# EasyEDA Pro project 主板以及2.4GHz接收器.eprj, board PARTITION1
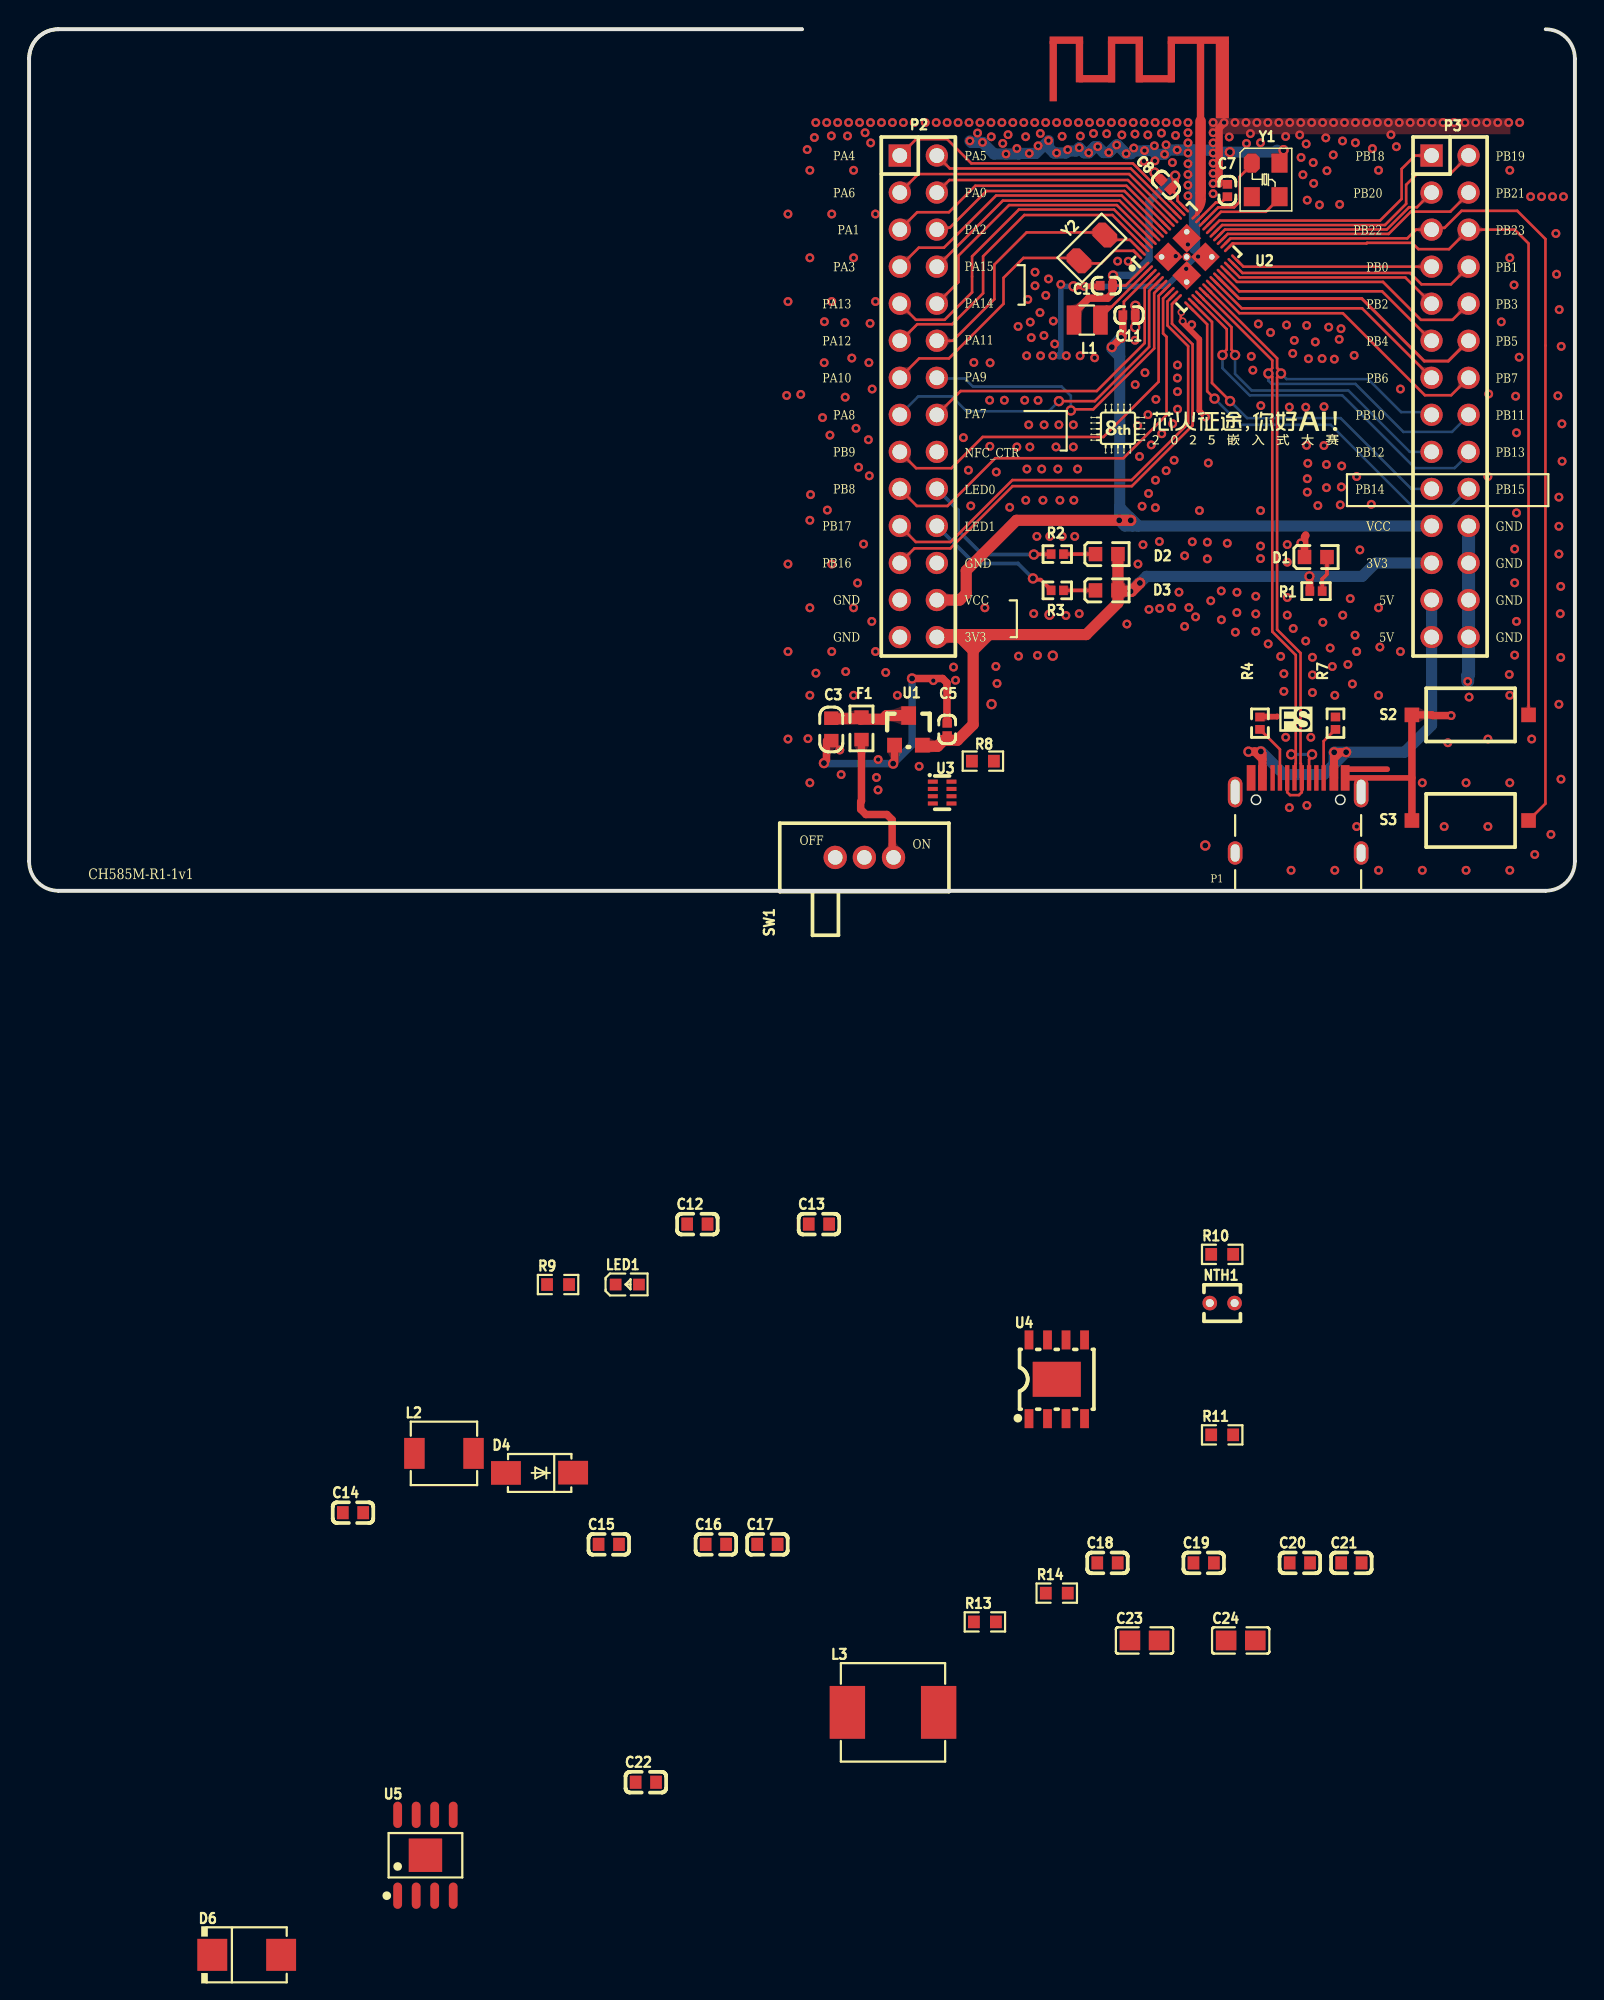
[diagram p10: board, top side]
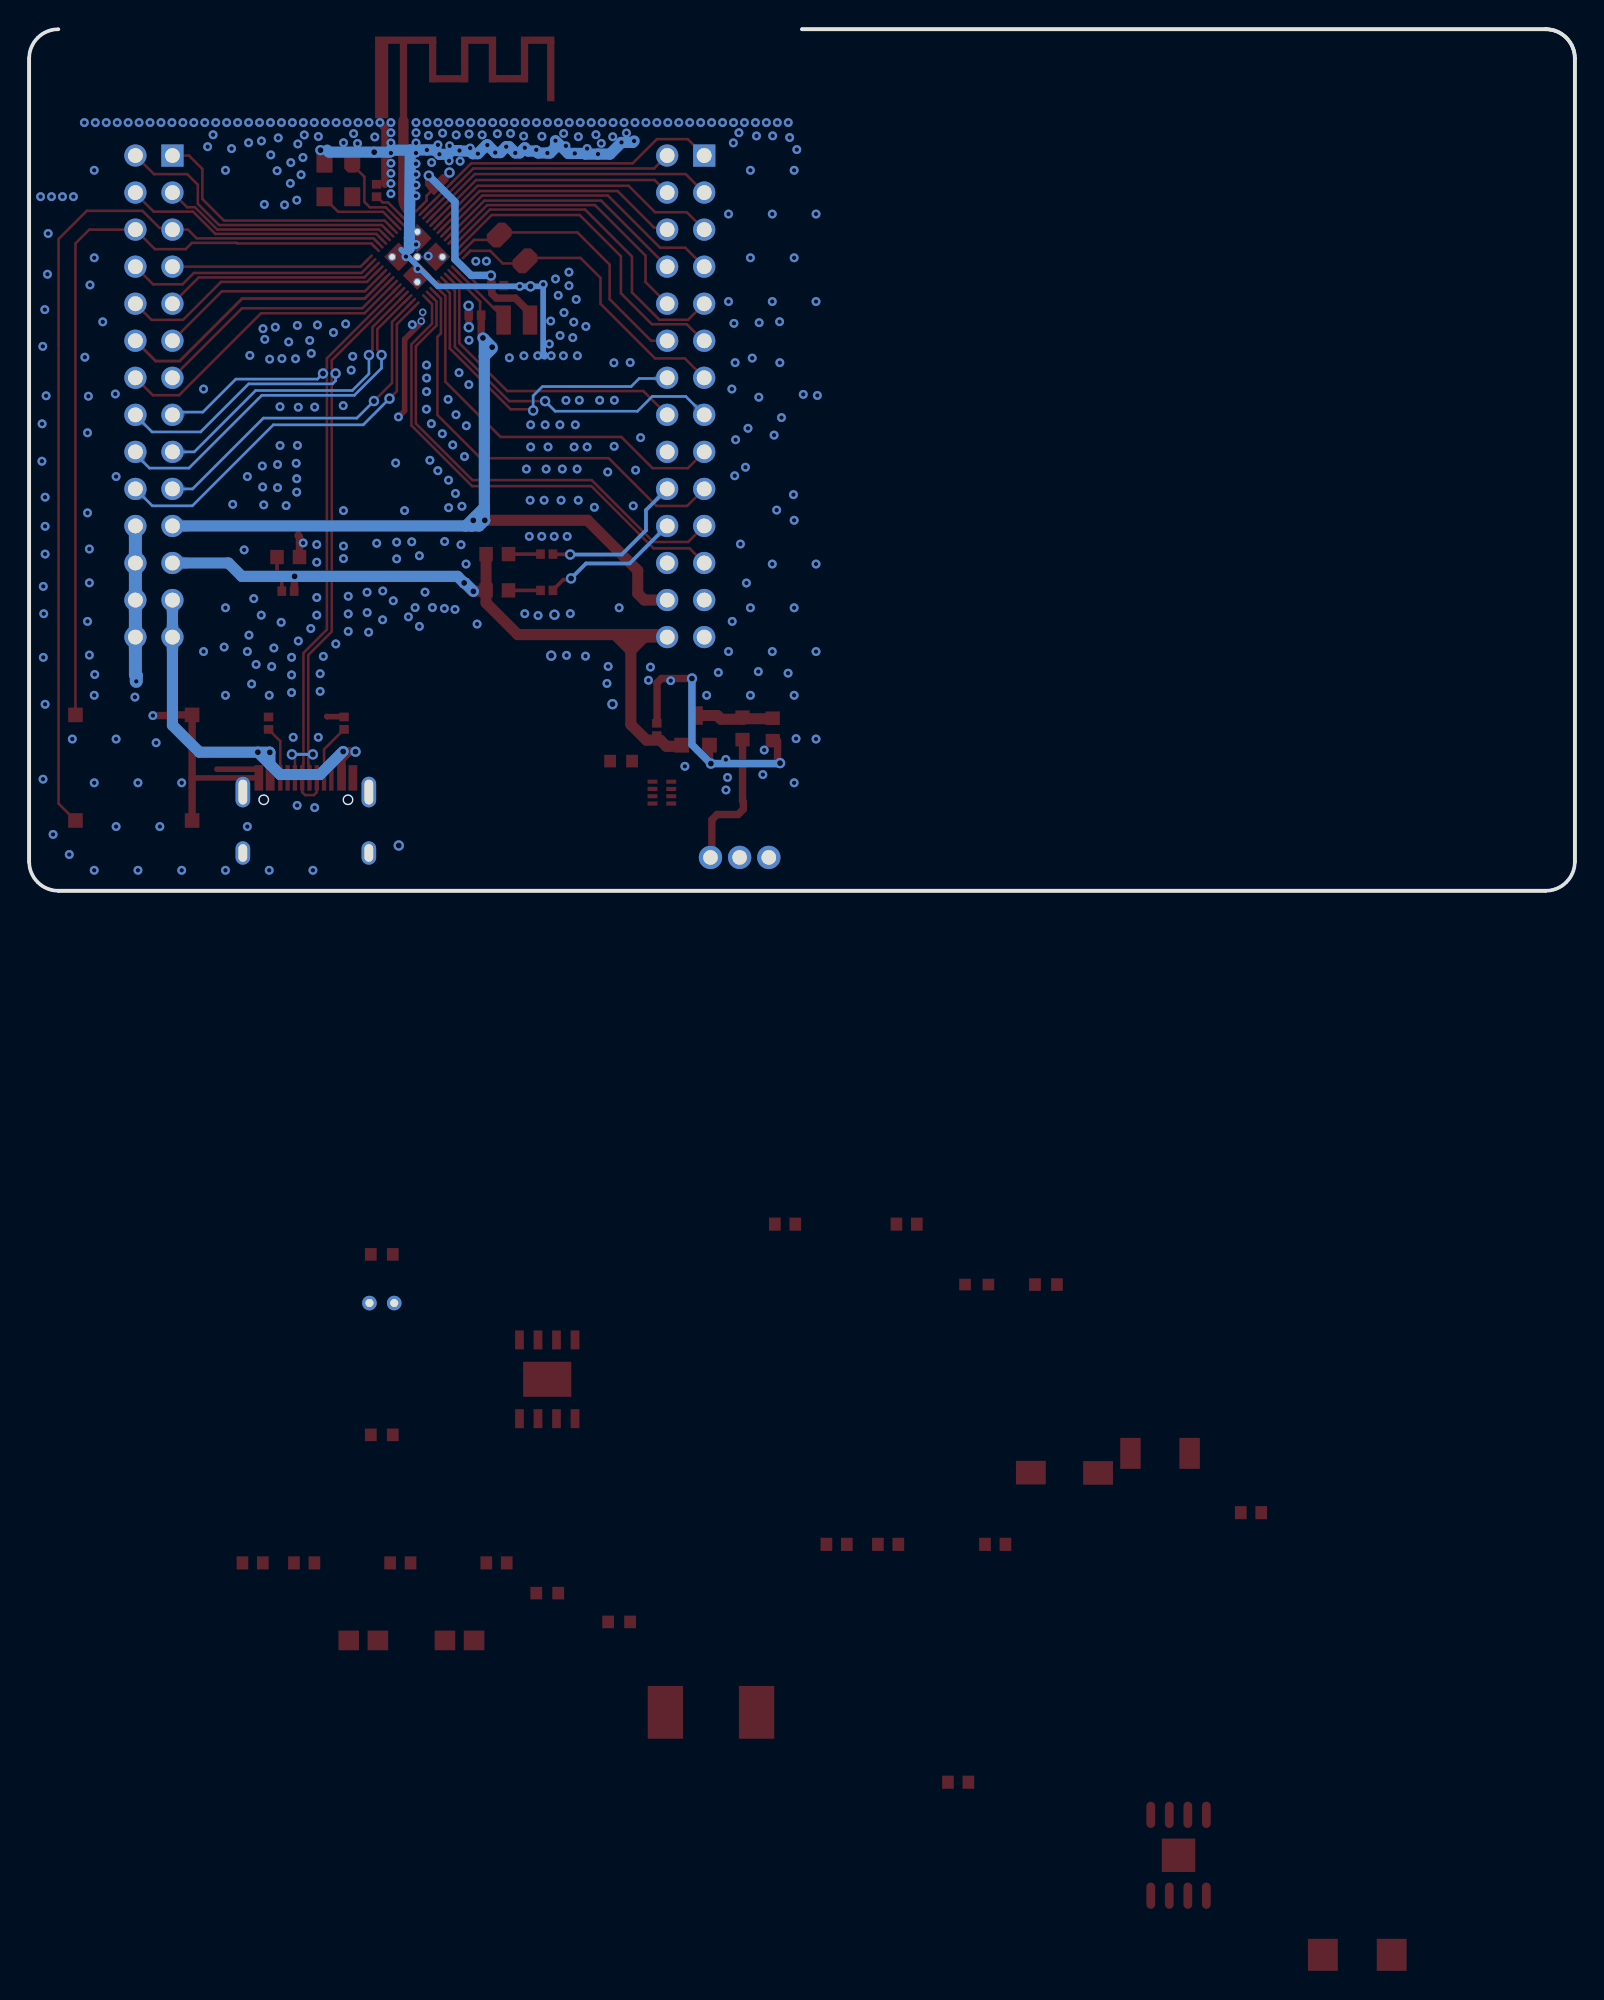
[diagram p11: board, bottom side, seen from below]

Outline 106 x 59.08 mm; copper layers: Top Layer, Bottom Layer. Coordinates in mm from the lower left corner of the outline.
Outline path: 0,57.08 0,2 ; 0,2 0,57.08 ; 0,2 arc(0.59,0.59) 2,0 ; 2,59.08 arc(0.59,58.49) 0,57.08 arc(0.59,58.49) 2,59.08 1.99,59.08 ; 1.99,59.08 53,59.08 1.99,59.08 ; 2,0 104,0 ; 2,0 104,0 ; 104,0 arc(105.41,0.59) 106,2 ; 104,59.08 arc(105.41,58.49) 106,57.08 ; 106,57.08 106,2 ; 106,57.08 106,2
Stack: Top Layer 0.0356mm / Dielectric1 0.32mm FR-4 er 4.8 / Bottom Layer 0.0356mm

## Design rules (mm)
net C3: CH585M-R1-1v1
net C5: CH585M-R1-1v1
net C7: CH585M-R1-1v1
net C8: CH585M-R1-1v1
net C11: CH585M-R1-1v1
net F1: CH585M-R1-1v1
net L1: CH585M-R1-1v1
net P2: CH585M-R1-1v1
net P3: CH585M-R1-1v1
net R1: CH585M-R1-1v1
net R2: CH585M-R1-1v1
net R3: CH585M-R1-1v1
net U1: CH585M-R1-1v1
net Y1: CH585M-R1-1v1
net Y2: CH585M-R1-1v1
net E1: CH585M-R1-1v1
net R4: CH585M-R1-1v1
net R7: CH585M-R1-1v1
net S1: CH585M-R1-1v1
net S2: CH585M-R1-1v1
net S3: CH585M-R1-1v1
net C1: CH585M-R1-1v1
net D1: CH585M-R1-1v1
net D2: CH585M-R1-1v1
net D3: CH585M-R1-1v1
net P4: CH585M-R1-1v1
net R8: CH585M-R1-1v1
net R11: CH585M-R1-1v1
net P1: CH585M-R1-1v1
net U2: CH585M-R1-1v1
net C4: CH585M-R1-1v1
net C6: CH585M-R1-1v1
net C9: CH585M-R1-1v1
net C10: CH585M-R1-1v1
net C12: CH585M-R1-1v1
net C13: CH585M-R1-1v1
net C14: CH585M-R1-1v1
net C15: CH585M-R1-1v1
net C16: CH585M-R1-1v1
net C17: CH585M-R1-1v1
net L2: CH585M-R1-1v1
net L3: CH585M-R1-1v1
net R12: CH585M-R1-1v1
net R13: CH585M-R1-1v1
net R14: CH585M-R1-1v1
net R15: CH585M-R1-1v1
net R16: CH585M-R1-1v1
net C2: CH585M-R1-1v1
net R17: CH585M-R1-1v1
net PB12: NewDifferentialPair2
net PB13: NewDifferentialPair2
net PB11: NewDifferentialPair1
net PB10: NewDifferentialPair1
spacing Clearance_1: track to track 0.152, other pairs 0.152 to 0.152
spacing Clearance (default): track to track 0.127, other pairs 0 to 0.152
spacing Clearance_3: track to track 0.254, other pairs 0 to 0.254
track width Width (default): min 0.127, default 0.178, max 1.27
differential pair DiffPairsRouting (default): width min 0.178, default 0.381, max 0.381; gap min 0.152, default 0.254
via RoutingVias (default): diameter min 0.508, default 0.61, max 1.27; hole min 0.305, default 0.305, max 0.711
net ANT uses Clearance_1

## Placement (name value [footprint] x y rotation side)
C1  4.7uF  [0402_C]  73.45 41.49 90 top
C3  10uF  [0603_C]  55.01 11.83 270 top
C5  2.2uF  [0402_C]  62.96 10.64 180 top
C7  0.47uF  [0402_C]  82.17 47.59 180 top
C8  0.1uF  [0402_C]  78.25 48.12 225 top
C11  2.2uF  [0402_C]  75.85 39.47 270 top
C12  22uF  [C0603]  45.82 -22.86 0 top
C13  22uF  [C0603]  54.16 -22.86 0 top
C14  100nF  [C0603]  22.21 -42.64 0 top
C15  10uF  [C0603]  39.75 -44.82 0 top
C16  10uF  [C0603]  47.09 -44.82 0 top
C17  10uF  [C0603]  50.63 -44.82 0 top
C18  10uF  [C0603]  73.95 -46.09 0 top
C19  10uF  [C0603]  80.55 -46.09 0 top
C20  10uF  [C0603]  87.14 -46.09 0 top
C21  10uF  [C0603]  90.68 -46.09 0 top
C22  100nF  [C0603]  42.29 -61.13 0 top
C23  22uF  [C0805]  76.49 -51.41 0 top
C24  22uF  [C0805]  83.09 -51.41 0 top
D1  POWER  [0603+]  89 22.88 180 top
D2  LED0  [0603+]  74.67 23.09 180 top
D3  LED1  [0603+]  74.67 20.6 180 top
D4  SS54  [SMA_L4.3-W2.6-LS5.0-FD]  35 -39.91 0 top
D6  SS54SMB  [SMB_L4.6-W3.6-LS5.3-RD]  14.92 -72.97 0 top
E1  ANTENNA  [ANT-F-1-2.4G-1.6mmFR4]  80.34 53.28 0 top
F1  500mA  [0603]  57.08 10.36 90 top
L1  10uH  [SMD_2x2mm]  72.56 39.13 180 top
L2  2.2uH  [IND-SMD_L4.4-W4.2]  28.45 -38.58 0 top
L3  15uH  [IND-SMD_L7.0-W6.6_FXL0630]  59.24 -56.34 0 top
LED1  LTST-C190KSKT  [LED0603-RD]  41.02 -27 0 top
NTH1  100K  [RES-TH_L2.5-W2.5-P1.70-D0.3]  81.82 -28.27 0 top
P1  TYPE-C FS-USB  [TYPE-C-Receptacle-2.0]  87.03 7.74 0 top
P2  HEADER 14x2  [IDC28-2.54MM]  59.71 50.42 0 top
P3  HEADER 14x2  [IDC28-2.54MM]  96.17 50.42 0 top
R1  1K  [0402]  88.68 20.55 180 top
R2  1K  [0402]  70.08 23.09 0 top
R3  1K  [0402]  70.08 20.6 0 top
R4  5.1K  [0402]  84.41 11.92 270 top
R7  5.1K  [0402]  89.58 11.07 90 top
R8  10kΩ  [R0603]  65.41 8.89 0 top
R9  1kΩ  [R0603]  36.27 -27 0 top
R10  82kΩ  [R0603]  81.82 -24.93 0 top
R11  1kΩ  [R0603]  81.82 -37.31 0 top
R13  10kΩ  [R0603]  65.54 -50.14 0 top
R14  3.16kΩ  [R0603]  70.47 -48.16 0 top
S2  RST#  [SMD_6.1x3.65x2.5mm-KEY]  94.83 12.06 0 top
S3  Download  [SMD_6.1x3.65x2.5mm-KEY]  94.83 4.82 0 top
SW1  SSSS916900  [SW-TH_SSSS916900]  57.28 2.29 90 top
U1  6219P33M  [SOT-23]  59.35 9.98 0 top
U2  CH585M  [QFN48_5X5]  79.38 43.46 315 top
U3  LM66200DRLR  [SOT-583-8_L2.1-W1.2-P0.50-LS1.6-BL]  62.61 6.73 270 top
U4  SCS5090EA  [ESOP-8_L4.9-W3.9-P1.27-LS6.0-BL-EP3.3]  70.47 -33.5 0 top
U5  TPS5450DDAR  [SOP-8_L4.9-W3.9-P1.27-LS6.0-BL-EP]  27.18 -66.14 0 top
Y1  32MHz  [XT3225]  83.85 49.89 270 top
Y2  32.768K  [fc-135]  72 43.2 45 top

## Footprints (pads in the part's own frame, mm; a bottom-side part is the same pattern mirrored in y, then rotated)
0402
  rect 0.6x0.65 smd: 1(0,0) 2(0.85,0)
0402_C
  rect 0.65x0.6 smd: 1(0,0) 2(0,-0.85)
0603
  rect 0.93x0.98 smd: 1(0,0) 2(1.54,0)
0603+
  rect 0.93x0.98 smd: 1(0,0) 2(1.54,0)
0603_C
  rect 0.93x0.98 smd: 1(0,0) 2(1.54,0)
ANT-F-1-2.4G-1.6mmFR4
  rect 0.8x0.6 smd: 0(1.483,0)
  rect 0.4x0.6 smd: 1(0,0)
C0603
  rect 0.8x0.9 smd: 1(-0.7,0) 2(0.7,0)
C0805
  rect 1.41x1.35 smd: 1(-1,0) 2(1,0)
ESOP-8_L4.9-W3.9-P1.27-LS6.0-BL-EP3.3
  rect 0.6x1.3 smd: 1(-1.905,-2.7) 2(-0.635,-2.7) 3(0.635,-2.7) 4(1.905,-2.7) 5(1.905,2.7) 6(0.635,2.7) 7(-0.635,2.7) 8(-1.905,2.7)
  rect 3.3x2.4 smd: 9(0,0)
fc-135
  custom 1.27x1.778 smd: 1(0,0) 2(2.5,0)
IDC28-2.54MM
  rect 1.524x1.524 hole 1.016: 1(0,0)
  round 1.524 hole 1.016: 2(2.54,0) 3(0,-2.54) 4(2.54,-2.54) 5(0,-5.08) 6(2.54,-5.08) 7(0,-7.62) 8(2.54,-7.62) 9(0,-10.16) 10(2.54,-10.16) 11(0,-12.7) 12(2.54,-12.7) 13(0,-15.24) 14(2.54,-15.24) 15(0,-17.78) 16(2.54,-17.78) 17(0,-20.32) 18(2.54,-20.32) 19(0,-22.86) 20(2.54,-22.86) 21(0,-25.4) 22(2.54,-25.4) 23(0,-27.94) 24(2.54,-27.94) 25(0,-30.48) 26(2.54,-30.48) 27(0,-33.02) 28(2.54,-33.02)
IND-SMD_L4.4-W4.2
  rect 1.4x2.12 smd: 1(2.028,0) 2(-2.028,0)
IND-SMD_L7.0-W6.6_FXL0630
  rect 2.424x3.62 smd: 1(3.128,0) 2(-3.128,0)
LED0603-RD
  rect 0.8x0.8 smd: 1(-0.799,0) 2(0.799,0)
QFN48_5X5
  round 0.559 hole 0.381: 0(-1.219,1.219) 0(-1.219,-1.219) 0(0,0) 0(1.219,1.219) 0(1.219,-1.219)
  rect 1.397x1.397 smd: 0(-0.901,0.908) 0(-0.901,-0.895) 0(0.902,0.908) 0(0.902,-0.895)
  oval 0.18x0.9 smd: 1(-1.575,-2.518) 2(-1.225,-2.518) 3(-0.875,-2.518) 4(-0.525,-2.518) 5(-0.175,-2.518) 6(0.175,-2.518) 7(0.525,-2.518) 8(0.875,-2.518) 9(1.225,-2.518) 10(1.575,-2.518) 25(1.575,2.518) 26(1.225,2.518) 27(0.875,2.518) 28(0.525,2.518) 29(0.175,2.518) 30(-0.175,2.518) 31(-0.525,2.518) 32(-0.875,2.518) 33(-1.225,2.518) 34(-1.575,2.518)
  oval 0.9x0.18 smd: 11(2.514,-2.275) 12(2.514,-1.925) 13(2.514,-1.575) 14(2.514,-1.225) 15(2.514,-0.875) 16(2.514,-0.525) 17(2.514,-0.175) 18(2.514,0.175) 19(2.514,0.525) 20(2.514,0.875) 21(2.514,1.225) 22(2.514,1.575) 23(2.514,1.925) 24(2.514,2.275) 35(-2.514,2.275) 36(-2.514,1.925) 37(-2.514,1.575) 38(-2.514,1.225) 39(-2.514,0.875) 40(-2.514,0.525) 41(-2.514,0.175) 42(-2.514,-0.175) 43(-2.514,-0.525) 44(-2.514,-0.875) 45(-2.514,-1.225) 46(-2.514,-1.575) 47(-2.514,-1.925) 48(-2.514,-2.275)
R0603
  rect 0.806x0.864 smd: 1(-0.753,0) 2(0.753,0)
RES-TH_L2.5-W2.5-P1.70-D0.3
  round 1 hole 0.55: 1(-0.85,0) 2(0.85,0)
SMA_L4.3-W2.6-LS5.0-FD
  rect 2.046x1.62 smd: 1(-2.304,-0.009) 2(2.304,0.009)
SMB_L4.6-W3.6-LS5.3-RD
  rect 2.047x2.192 smd: 1(-2.361,0) 2(2.361,0)
SMD_2x2mm
  rect 1x2 smd: 1(-0.905,0) 2(0.905,0)
SMD_6.1x3.65x2.5mm-KEY
  rect 1x1 smd: 1(0,0) 2(8,0)
SOP-8_L4.9-W3.9-P1.27-LS6.0-BL-EP
  oval 0.6x1.8 smd: 1(-1.905,-2.772) 2(-0.635,-2.772) 3(0.635,-2.772) 4(1.905,-2.772) 5(1.905,2.772) 6(0.635,2.772) 7(-0.635,2.772) 8(-1.905,2.772)
  rect 2.29x2.29 smd: 9(0,0)
SOT-23
  rect 1.016x1.016 smd: 1(0,0) 2(1.905,0)
  rect 1.016x1.27 smd: 3(0.965,2.032)
SOT-583-8_L2.1-W1.2-P0.50-LS1.6-BL
  rect 0.28x0.68 smd: 1(-0.75,-0.64) 2(-0.25,-0.64) 3(0.25,-0.64) 4(0.75,-0.64) 5(0.75,0.64) 6(0.25,0.64) 7(-0.25,0.64) 8(-0.75,0.64)
SW-TH_SSSS916900
  round 1.6 hole 1: 1(0,2) 2(0,0) 3(0,-2)
TYPE-C-Receptacle-2.0
  oval 1x2.1 hole 0.6x1.7: 0(-4.32,-0.97) 0(4.32,-0.97)
  oval 1x1.6 hole 0.6x1.2: 0(-4.32,-5.15) 0(4.32,-5.15)
  rect 0.6x1.75 smd: A1(-3.225,0) A4(-2.45,0) B1(3.225,0) B4(2.45,0)
  rect 0.3x1.75 smd: A5(-1.25,0) A6(-0.25,0) A7(0.25,0) A8(1.25,0) B5(1.75,0) B6(0.75,0) B7(-0.75,0) B8(-1.75,0)
XT3225
  custom 1.3x1.1 smd: 1(0,0)
  rect 1.3x1.1 smd: 2(2.3,0) 3(2.3,1.9) 4(0,1.9)

## Nets
+3V3: C5.1 D2.1 D3.1 P2.28 P3.23 R1.2 U1.2
+5V: C12.2 C13.2 C14.2 L2.1 P1.A4 P1.B4 P1.B5 P3.25 P3.27 R7.1 R8.2 R9.1 U3.3 U4.1
GND: C1.1 C3.2 C5.2 C7.2 C8.2 C11.1 C12.1 C13.1 C14.1 C15.1 C16.1 C17.1 C18.1 C19.1 C20.1 C21.1 C23.2 C24.2 D1.2 NTH1.2 P1.A1 P1.B1 P2.24 P2.25 P2.27 P3.22 P3.24 P3.26 P3.28 R4.1 R7.2 R10.2 R11.2 R14.2 S2.1 S3.1 U1.1 U2.0 U3.1 U3.4 U3.5 U4.2 U4.9 U5.6 Y1.2 Y1.4
V5V: C3.1 F1.2 U1.3
VCC: C11.2 P2.26 P3.21 U2.3
VINTA: C7.1 U2.33
ANT: E1.1 U2.34
BAT+: C18.2 C19.2 C20.2 C21.2 U4.5 U5.7
BATO: C23.1 C24.1 L3.2 R13.1 U3.6
BOOT: P3.5 S3.2 U2.26
EP: C22.2 D6.1 L3.1 U5.8
FB: R13.2 R14.1 U5.4
LED0: P2.20 R2.1
LED1: P2.22 R3.1
LX: D4.1 L2.2 U4.3
PA0: P2.4 U2.39
PA1: P2.5 U2.40
PA2: P2.6 U2.41
PA3: P2.7 U2.42
PA4: P2.1 U2.36
PA5: P2.2 U2.37
PA6: P2.3 U2.38
PA7: P2.16 U2.4
PA8: P2.15 U2.5
PA9: P2.14 U2.6
PA10: P2.13 U2.48 Y2.1
PA11: P2.12 U2.47 Y2.2
PA12: P2.11 U2.46
PA13: P2.9 U2.45
PA14: P2.10 U2.44
PA15: P2.8 U2.43
PB0: P3.7 U2.24
PB1: P3.8 U2.23
PB2: P3.9 U2.22
PB3: P3.10 U2.21
PB4: P3.11 U2.20
PB5: P3.12 U2.19
PB6: P3.13 U2.18
PB7: P3.14 U2.17
PB10: P1.A7 P1.B7 P3.15 U2.16
PB11: P1.A6 P1.B6 P3.16 U2.15
PB12: P3.17 U2.14
PB13: P3.18 U2.13
PB14: P3.19 U2.12
PB15: P3.20 U2.11
PB18: P3.1 U2.30
PB19: P3.2 U2.29
PB20: P3.3 U2.28
PB21: P3.4 U2.27
PB23: P3.6 S2.2 U2.25
STAT: LED1.1 U4.8
V_SYS: SW1.2 U3.2 U3.7
VBS: C15.2 C16.2 C17.2 D4.2 U4.4
VDCID: C1.2 C8.1 L1.2 U2.1 U2.35
VSW: L1.1 U2.2
X32MI: U2.32 Y1.1
X32MO: U2.31 Y1.3
$1N3: F1.1 SW1.3
$1N110: P1.A5 R4.2
$1N164: D1.1 R1.1
$1N985: D2.2 R2.2
$1N986: D3.2 R3.2
$1N5275: R8.1 U3.8
$1N7704: LED1.2 R9.2
$1N7911: NTH1.1 R10.1 U4.7
$1N8019: R11.1 U4.6
$1N8947: C22.1 U5.1
$1N8982: D6.2 U5.9

Pads without a net: E1 0; P1 0 A8 B8; P2 17 18 19 21 23; SW1 1; U2 7 8 9 10; U5 2 3 5

## Via types
v1: diameter 0.711, hole 0.406, Top Layer to Bottom Layer, 38 vias
v2: diameter 0.61, hole 0.305, Top Layer to Bottom Layer, 443 vias
v3: diameter 0.508, hole 0.305, Top Layer to Bottom Layer, 2 vias

## Routing (per net, layer and track width the routed paths; a pad name or vN(x,y) marks a point on that pad's centre or on a via; arc(x,y) is an arc through that point)
+3V3: length 55.3
  Top Layer w0.508: 87.82,20.55 87.81,20.56 87.81,21.55 v1(87.8,21.56)
  Top Layer w0.762: 74.67,20.55 74.67,22.88 ; 74.67,20.55 75.52,20.55 v1(75.53,20.53) 75.6,20.53 v1(76.17,21.11) ; 74.67,20.55 74.67,19.74 72.49,17.57 65.83,17.57 ; 64.74,16.47 65.83,17.57 ; 64.74,16.47 64.74,17.57 ; 64.74,16.47 63.81,17.39 ; 64.74,16.47 64.74,11.4 63.66,10.32 62.72,10.32 62.3,9.91 61.25,9.91 ; 65.83,17.57 64.74,17.57 ; 64.74,17.57 63.99,17.57 ; 63.81,17.39 63.99,17.57 ; 63.81,17.39 P2.28 ; 63.99,17.57 62.54,17.57
  Bottom Layer w0.762: v1(75.53,20.53) 76.11,21.11 v1(76.17,21.11) 76.63,21.56 v1(87.8,21.56) 91.41,21.56 92.33,22.47 P3.23
+5V: length 34.3
  Top Layer w0.178: 89.56,11.07 89.35,10.85 89.35,10.83 88.78,10.26 P1.B5
  Top Layer w0.559: 89.91,9.5 89.5,9.5 v1(89.5,9.49) 89.49,9.48 89.49,9.08 ; 89.91,9.5 90.31,9.5 v1(90.31,9.5) ; 89.91,9.5 89.49,9.08 ; 84.04,9.55 84.46,9.55 v1(84.47,9.55) 84.47,9.51 84.57,9.4 84.57,9.01 ; 84.04,9.55 83.63,9.55 v1(83.62,9.54) ; 84.04,9.55 84.57,9.01 ; P1.B4 89.49,7.75 89.49,9.08 ; 84.57,9.01 P1.A4
  Bottom Layer w0.762: 89.5,8.68 v1(89.5,9.49) 89.5,9.5 v1(90.31,9.5) ; 89.5,8.68 v1(90.31,9.5) ; 89.5,8.68 88.78,7.97 86.05,7.97 v1(84.47,9.55) ; v1(90.31,9.5) 94.32,9.5 96.17,11.35 P3.27 P3.25
GND: length 113.3
  Top Layer w0.178: 78.99,39.67 78.98,39.66 78.98,39.08
  Top Layer w0.381: 85.6,11.96 85.58,11.94 84.43,11.94 84.41,11.96 ; 94.83,7.74 P1.B1 90.25,8.23 90.36,8.34 93.13,8.34 ; 70.18,16.14 v1(70.2,16.12) ; C1.1 73.4,41.44 v2(72.35,41.44) v1(71.62,41.44) ; 79.01,39.06 80.25,37.82 80.25,32.92 v2(80.68,32.49)
  Top Layer w0.508: v1(60.55,14.56) 62.64,14.56 62.94,14.26 62.94,11.5 C5.2 ; v1(54.51,8.75) 54.51,8.81 54.68,8.98 54.68,10.29 ; v2(97.51,12.01) 96.24,12.01 96.19,12.06 S2.1 S3.1 ; v1(75.86,40.11) 75.86,40.11 75.86,39.48 C11.1 75.85,38.65 ; v1(59.25,8.72) 59.25,8.77 59.35,8.87 U1.1 ; 87.54,24.4 87.54,24.34 87.46,24.26 D1.2 ; 81.6,48.44 81.6,52.3 81.89,52.58 ; v1(77.18,49.25) 77.18,49.2 C8.2 77.65,48.67
  Bottom Layer w0.381: 70.65,36.61 70.65,36.8 ; 80.49,43.96 77.98,41.44 v2(72.35,41.44) v1(71.62,41.44) 70.95,41.44 70.86,41.54 70.81,41.54 70.75,41.48 70.75,36.65
  Bottom Layer w0.508: v1(54.51,8.75) 54.54,8.72 v1(59.25,8.72) 60.55,10.02 v1(60.55,14.56)
  Bottom Layer w0.762: 69.9,51.22 69.9,50.97 70.28,50.59 v2(70.46,50.59) 71.09,50.59 71.22,50.72 71.78,50.72 v2(72.01,50.95) 72.37,50.6 v2(72.66,50.6) 73.09,51.02 v2(73.28,51.02) 73.69,50.62 v2(74.04,50.62) 74.56,51.14 v2(74.58,51.14) 74.64,51.14 v2(75.23,50.54) 75.58,50.54 75.76,50.72 76.47,50.72 ; 79.86,50.78 79.47,50.78 79.46,50.8 v2(78.73,50.8) 78.16,50.8 v2(77.86,50.5) 77.28,50.5 77.03,50.76 v2(76.49,50.76) ; 79.86,50.78 81.19,50.78 81.33,50.65 v1(82.34,50.65) 85.43,50.65 85.56,50.78 ; 79.86,50.78 79.93,44.04 ; v2(69.9,51.44) 69.03,50.56 v2(68.58,50.56) 67.9,50.56 67.86,50.52 v2(66.99,50.52) 66.17,50.52 65.38,51.31 v2(65.38,51.32) 64.61,51.32 v2(64.51,51.41)
  Bottom Layer w0.889: v2(98.66,14.36) 98.66,14.77 98.71,14.83 P3.28 P3.26 P3.24 P3.22
  vias: v1(66,12.8) v1(69.98,18.93) v1(75.85,38.64) v1(80.65,3.1) v1(86.02,50.78) v2(51.95,33.96) v2(52.04,46.4) v2(52.04,40.4) v2(52.04,22.4) v2(52.04,16.4) v2(52.04,10.4) v2(52.91,34.04) v2(53.36,50.82) v2(53.41,10.43) v2(53.54,49.4) v2(53.54,43.4) v2(53.54,25.4) v2(53.54,19.4) v2(53.54,13.4) v2(53.54,7.4) v2(53.59,27.16) v2(53.85,51.65) v2(53.94,52.68) v2(53.95,14.92) v2(54.41,32.45) v2(54.54,39.02) v2(54.52,36.21) v2(54.69,52.68) v2(54.74,26.1) v2(54.92,31.24) v2(55.01,51.76) v2(55.04,46.4) v2(55.04,40.4) v2(55.04,22.4) v2(55.04,16.4) v2(55.45,52.68) v2(55.59,9.65) v2(55.68,7.97) v2(55.94,38.96) v2(55.96,33.84) v2(56,15.03) v2(56.12,51.76) v2(56.2,52.68) v2(56.41,36.53) v2(56.54,49.4) v2(56.54,43.4) v2(56.54,19.4) v2(56.54,13.4) v2(56.7,31.71) v2(56.81,21.1) v2(56.95,52.68) v2(56.88,29.04) v2(57.22,23.77) v2(57.33,51.98) v2(57.59,36.21) v2(57.55,30.93) v2(57.62,28.46) v2(57.7,52.68) v2(57.71,51.28) v2(57.67,38.91) v2(57.81,34.4) v2(57.79,18.47) v2(58.04,46.4) v2(58.04,40.4) v2(58.04,16.4) v2(58.11,7.77) v2(58.22,9) v2(58.21,6.91) v2(58.45,52.68) v2(58.74,14.97) v2(59.2,52.68) v2(59.54,13.4) v2(59.95,52.68) v2(60.7,52.68) v2(61.03,8.53) v2(61.45,52.68) v2(62,14.41) v2(62.2,52.68) v2(62.95,52.68) v2(63.39,15.34) v2(63.53,14.43) v2(63.7,52.68) v2(64.07,31.07) v2(64.41,28.84) v2(64.46,52.68) v2(64.57,26.39) v2(64.78,36.22) v2(65.04,51.96) v2(65.21,52.68) v2(65.54,19.4) v2(65.9,36.2) v2(65.87,33.64) v2(65.88,30.48) v2(65.96,52.68) v2(65.98,51.7) v2(66.32,28.72) v2(66.3,15.39) v2(66.38,14.21) v2(66.71,52.68) v2(66.77,51.25) v2(66.88,33.64) v2(67.13,51.85) v2(67.24,26.3) v2(67.46,52.68) v2(67.74,50.9) v2(67.74,30.43) v2(67.82,38.7) v2(67.85,16.09) v2(68.21,52.68) v2(68.34,51.71) v2(68.27,33.64) v2(68.34,26.78) v2(68.41,36.69) v2(68.42,28.92) v2(68.49,40.55) v2(68.55,31.95) v2(68.63,30.43) v2(68.65,38.99) v2(68.72,37.93) v2(68.89,19) v2(68.96,52.68) v2(68.98,42.42) v2(68.98,41.49) v2(69.11,24.3) v2(69.19,51.08) v2(69.19,33.63) v2(69.15,16.14) v2(69.34,51.93) v2(69.32,39.65) v2(69.36,36.69) v2(69.44,28.92) v2(69.52,26.78) v2(69.59,38.07) v2(69.6,31.95) v2(69.71,52.68) v2(69.72,40.83) v2(69.9,41.95) v2(69.99,24.3) v2(70.23,39.07) v2(70.2,36.69) v2(70.33,37.49) v2(70.42,30.43) v2(70.46,52.68) v2(70.55,28.92) v2(70.62,31.95) v2(70.75,41.58) v2(70.69,26.78) v2(70.84,51.73) v2(70.85,24.3) v2(71.12,36.69) v2(71.1,18.87) v2(71.21,52.68) v2(71.22,50.81) v2(71.61,31.95) v2(71.61,30.43) v2(71.64,26.78) v2(71.7,24.3) v2(71.9,28.92) v2(71.96,52.68) v2(72.01,19) v2(72.09,51.75) v2(72.07,36.69) v2(72.71,52.68) v2(72.99,51.93) v2(73.07,36.55) v2(73.46,52.68) v2(73.89,51.91) v2(74.22,52.68) v2(74.65,43.17) v2(74.94,51.83) v2(74.97,52.68) v2(75.28,18.29) v2(75.37,43.17) v2(75.72,52.68) v2(75.84,51.89) v2(75.76,50.93) v2(75.84,37.75) v2(75.85,34.71) v2(76.02,31.89) v2(76.04,22.4) v2(76.15,29.78) v2(76.32,26.37) v2(76.45,50.03) v2(76.39,23.73) v2(76.47,52.68) v2(76.52,35.53) v2(76.72,51.83) v2(76.73,32.65) v2(76.77,27.24) v2(76.8,19.29) v2(76.95,30.57) v2(77.22,52.68) v2(77.16,51.08) v2(77.2,50.05) v2(77.24,28.15) v2(77.23,26.27) v2(77.27,33.7) v2(77.51,23.95) v2(77.53,19.36) v2(77.65,51.95) v2(77.67,31.34) v2(77.97,52.68) v2(77.97,51.15) v2(77.97,28.8) v2(78.35,19.42) v2(78.4,49.94) v2(78.42,32.03) v2(78.52,29.52) v2(78.62,51.8) v2(78.63,43.52) v2(78.72,52.68) v2(78.74,35.16) v2(78.75,36.05) v2(78.75,34.23) v2(78.76,33.02) v2(78.85,20.48) v2(79.24,22.97) v2(79.24,18.13) v2(79.35,42.65) v2(79.47,52.68) v2(79.47,51.98) v2(79.47,51.28) v2(79.47,50.59) v2(79.47,49.85) v2(79.47,49.12) v2(79.47,48.39) v2(79.47,47.65) v2(79.46,44.32) v2(79.53,19.42) v2(79.73,38.82) v2(79.76,23.93) v2(79.99,18.78) v2(80.16,43.49) v2(80.26,26.07) v2(80.8,23.9) v2(80.8,22.76) v2(80.87,29.33) v2(81.03,19.89) v2(81.19,52.68) v2(81.19,51.98) v2(81.19,51.28) v2(81.19,50.59) v2(81.19,49.89) v2(81.19,49.19) v2(81.19,48.5) v2(81.19,47.8) v2(81.75,20.56) v2(81.76,18.58) v2(81.94,52.68) v2(82.17,23.83) v2(82.3,51.69) v2(82.7,52.68) v2(82.72,17.73) v2(82.83,20.47) v2(82.82,19.08) v2(83.45,52.68) v2(83.48,51.24) v2(83.75,51.92) v2(83.81,36.65) v2(83.92,35.7) v2(84.12,20.19) v2(84.12,18.98) v2(84.12,17.79) v2(84.2,52.68) v2(84.29,38.87) v2(84.44,51.29) v2(84.45,26.07) v2(84.45,23.64) v2(84.45,22.78) v2(84.46,33.27) v2(84.95,52.68) v2(84.97,16.93) v2(85.13,38.28) v2(85.7,52.68) v2(85.83,16.07) v2(86.05,14.88) v2(86.05,13.67) v2(86.17,51.72) v2(86.23,38.79) v2(86.17,10.52) v2(86.28,23.74) v2(86.28,22.53) v2(86.28,20.11) v2(86.28,18.9) v2(86.45,52.68) v2(86.42,33.17) v2(86.42,5.7) v2(86.54,1.4) v2(86.66,36.85) v2(86.69,17.98) v2(86.76,37.74) v2(87.13,51.83) v2(87.2,52.68) v2(87.22,50.28) v2(87.21,23.85) v2(87.35,49.1) v2(87.55,33.16) v2(87.54,17.13) v2(87.58,51.21) v2(87.65,47.36) v2(87.61,38.77) v2(87.6,30.54) v2(87.62,5.85) v2(87.73,36.48) v2(87.69,29.31) v2(87.65,28.26) v2(87.65,27.33) v2(87.89,10.52) v2(87.95,52.68) v2(88,16.01) v2(88,14.8) v2(88,13.59) v2(88.06,49.93) v2(88.09,48.51) v2(88.2,37.63) v2(88.38,26.41) v2(88.49,47.03) v2(88.7,52.68) v2(88.67,36.49) v2(88.72,18.41) v2(88.8,33.19) v2(88.79,30.53) v2(88.92,51.63) v2(89,49.37) v2(88.97,29.23) v2(88.97,27.64) v2(89.12,38.65) v2(89.22,16.65) v2(89.43,50.46) v2(89.37,15.38) v2(89.45,52.68) v2(89.51,36.45) v2(89.54,13.4) v2(89.54,1.4) v2(89.84,37.81) v2(89.87,47.06) v2(89.91,26.46) v2(89.97,38.54) v2(90.01,29.13) v2(89.99,27.69) v2(90.07,51.42) v2(90.08,18.9) v2(90.2,52.68) v2(90.44,15.52) v2(90.6,20.03) v2(90.74,14.18) v2(90.87,36.71) v2(90.93,17.53) v2(90.95,52.68) v2(90.95,51.29) v2(91.04,28.4) v2(91.04,16.4) v2(91.04,4.4) v2(91.26,23.37) v2(91.71,52.68) v2(92.04,26.5) v2(92.12,50.89) v2(92.46,52.68) v2(92.54,49.4) v2(92.54,19.4) v2(92.54,13.4) v2(92.54,1.4) v2(92.63,16.71) v2(93.21,52.68) v2(93.39,51.84) v2(93.76,51.02) v2(93.96,52.68) v2(94.04,34.4) v2(94.04,16.4) v2(94.71,52.68) v2(95.46,52.68) v2(95.54,7.4) v2(95.54,1.4) v2(96.21,52.68) v2(96.96,52.68) v2(97.04,4.4) v2(97.29,10.15) v2(97.71,52.68) v2(98.46,52.68) v2(98.54,7.4) v2(98.54,1.4) v2(98.75,13.28) v2(99.21,52.68) v2(99.96,52.68) v2(100.04,28.4) v2(100.04,10.4) v2(100.04,4.4) v2(100.09,34.07) v2(100.71,52.68) v2(100.96,39.01) v2(101.47,52.68) v2(101.54,49.4) v2(101.54,43.4) v2(101.5,14.83) v2(101.54,13.4) v2(101.54,7.4) v2(101.54,1.4) v2(101.83,41.54) v2(101.94,33.91) v2(101.87,23.44) v2(101.87,21.11) v2(101.87,16.16) v2(102,31.4) v2(102,25.91) v2(102,18.47) v2(102.22,52.68) v2(102.18,36.59) v2(102.97,47.6) v2(103.04,10.4) v2(103.25,2.49) v2(103.72,47.6) v2(104.36,3.86) v2(104.47,47.6) v2(104.7,45.07) v2(104.75,42.28) v2(104.84,33.94) v2(104.93,39.85) v2(104.91,26.99) v2(104.91,24.99) v2(104.91,23.09) v2(104.91,12.79) v2(105.03,20.87) v2(105,19) v2(105.03,16) v2(105.05,7.65) v2(105.07,37.33) v2(105.11,32.02) v2(105.13,29.45) v2(105.22,47.6) v3(79.01,39.67) v3(79.11,39.06)
V5V: length 5.4
  Top Layer w0.762: 60.31,12.02 58.81,12.02 58.55,11.76 57.03,11.76 56.99,11.8 55.01,11.8
VCC: length 61.3
  Top Layer w0.178: C11.2 75.07,39.55 75.07,40.39 U2.3
  Top Layer w0.508: v1(74.25,37.28) v1(74.88,37.91) 75,38.03 C11.2
  Top Layer w0.762: P2.26 63.82,19.94 64.26,20.38 64.26,21.96 67.71,25.4 v1(74.75,25.4) 75.54,25.4 v1(75.55,25.4)
  Bottom Layer w0.762: 74.25,37.18 74.79,36.64 ; 74.79,36.64 74.79,26.29 ; 74.79,36.64 74.79,37.82 ; 74.79,26.29 74.79,25.89 ; 74.79,26.29 76.06,25.02 ; v1(74.25,37.28) 74.79,37.82 ; 74.79,37.82 v1(74.88,37.91) ; 76.06,25.02 P3.21 ; 76.06,25.02 75.66,25.02 ; 74.79,25.89 75.66,25.02 ; 74.79,25.89 74.79,25.44 v1(74.75,25.4) 75.14,25.02 75.66,25.02
VINTA: length 2.5
  Top Layer w0.178: C7.1 82.15,47.59 81.76,47.2 81.39,47.2 U2.33
(no net): length 123.9
  Top Layer w0.178: P2.17 60.83,28.98 63.25,28.98 65.39,31.12 73.67,31.12 77.46,34.91 77.46,40.8 U2.7 ; P2.23 60.71,23.48 63.18,23.48 67.44,27.74 75.62,27.74 79.79,31.91 79.79,37.47 78.37,38.88 78.37,40.23 78.72,40.57 ; P2.19 60.88,26.39 62.98,26.39 66.25,29.66 75.04,29.66 78,32.62 78,37.98 77.76,38.22 77.76,40.61 U2.8 ; P2.21 60.81,23.92 63.18,23.92 67.43,28.16 75.61,28.16 79.48,32.03 79.48,37.34 78.07,38.76 78.07,40.42 U2.9
ANT: length 13.7
  Top Layer w0.178: 80.23,47.84 80.23,46.79 arc(80.18,46.56) 80.05,46.36 ; 80.05,46.36 80.24,46.55 arc(80.51,46.95) 80.6,47.42 80.6,48.69 ; 80.05,46.36 arc(80.05,46.36) U2.34 ; 80.05,46.36 arc(80.05,46.36) U2.34 ; 80.05,46.36 arc(80.26,46.67) 80.33,47.04 80.33,47.89 ; 80.05,46.36 arc(80.06,46.37) 80.07,46.38 ; 80.05,46.36 arc(80.05,46.36) U2.34 ; 80.05,46.36 arc(80.06,46.37) 80.07,46.38 ; 80.05,46.36 arc(80.05,46.36) U2.34 ; 80.05,46.36 arc(80.05,46.36) U2.34 ; 80.05,46.36 arc(80.06,46.37) 80.07,46.38 ; 80.05,46.36 arc(80.35,46.8) 80.45,47.33 80.45,47.82 ; 80.05,46.36 arc(80.05,46.36) U2.34 ; 80.05,46.36 arc(80.06,46.38) 80.06,46.4 80.06,47.86 ; 80.05,46.36 arc(80.05,46.36) U2.34
  Top Layer w0.714: 80.33,47.89 80.33,52.79
BOOT: length 64
  Top Layer w0.178: U2.26 82.39,44.73 94.51,44.73 95.11,45.33 P3.5 96.29,45.46 97.06,45.46 98.23,46.62 102.05,46.62 103.98,44.69 103.98,5.98 S3.2
LED0: length 10.5
  Top Layer w0.254: R2.1 70.07,23.07 68.91,23.07 v1(68.9,23.06)
  Bottom Layer w0.254: P2.20 63.7,26.1 63.7,24.72 65.36,23.06 v1(68.9,23.06)
LED1: length 9.7
  Top Layer w0.254: R3.1 70.08,20.62 69.37,21.33 68.93,21.33 v1(68.84,21.42)
  Bottom Layer w0.254: v1(68.84,21.42) 67.81,22.44 64.82,22.44 P2.22
PA0: length 17.5
  Top Layer w0.178: P2.4 63.11,48.73 75.35,48.73 U2.39
PA1: length 20.6
  Top Layer w0.178: U2.40 75.25,48.34 64.89,48.34 63.07,46.53 60.9,46.53 P2.5
PA2: length 17.7
  Top Layer w0.178: P2.6 62.38,45.47 63.13,45.47 65.65,47.98 75.11,47.98 77.73,45.36
PA3: length 20.9
  Top Layer w0.178: U2.42 74.93,47.67 66.31,47.67 62.73,44.09 61.01,44.09 P2.7
PA4: length 21.8
  Top Layer w0.178: U2.36 78.22,47.35 78.21,47.35 77.05,48.51 77.05,48.52 75.69,49.88 64.61,49.88 62.95,51.54 60.83,51.54 P2.1
PA5: length 18.2
  Top Layer w0.178: U2.37 75.55,49.53 63.14,49.53 P2.2
PA6: length 20.5
  Top Layer w0.178: P2.3 60.98,49.14 75.43,49.14 78.47,46.11
PA7: length 21.1
  Top Layer w0.178: U2.4 76.5,41.32 76.5,37.55 73.21,34.27 63.88,34.27 P2.16
PA8: length 24.7
  Top Layer w0.178: v1(70.62,33.57) 73.08,33.57 76.81,37.3 76.81,41.13 U2.5
  Bottom Layer w0.178: P2.15 60.97,33.9 63.27,33.9 64.28,32.88 69.93,32.88 v1(70.62,33.57)
PA9: length 22.8
  Top Layer w0.178: v1(71.44,32.93) 71.52,33.01 72.98,33.01 77.15,37.19 77.15,40.99 U2.6
  Bottom Layer w0.178: v1(71.44,32.93) 71.44,33.94 70.8,34.57 64.72,34.57 64.16,35.13 62.29,35.13 P2.14
PA10: length 20.8
  Top Layer w0.178: 59.83,35.4 59.93,35.4 61.03,36.5 63.07,36.5 66.82,40.25 66.82,42.03 68.19,43.39 71.8,43.39 Y2.1 ; 75.74,43.89 U2.48 ; 75.74,43.89 75.73,43.88 74.39,43.88 73.52,43.02 72.33,43.02 72.27,42.95
PA11: length 19
  Top Layer w0.178: Y2.2 73.58,45.14 68.4,45.14 66.19,42.94 66.19,40.57 63.34,37.72 P2.12 ; 73.68,44.55 73.76,44.64 75.49,44.64 U2.47
PA12: length 22.7
  Top Layer w0.178: 59.77,37.72 60.9,38.85 63.29,38.85 65.42,40.97 65.42,43.51 68.25,46.34 74.28,46.34 76.49,44.13
PA13: length 23
  Top Layer w0.178: U2.45 74.4,46.71 67.88,46.71 64.66,43.5 64.66,41.03 62.78,39.15 60.81,39.15 P2.9
PA14: length 19.6
  Top Layer w0.178: U2.44 74.59,47.02 67.2,47.02 63.73,43.55 63.73,41.74 P2.10
PA15: length 17.9
  Top Layer w0.178: P2.8 66.77,47.32 74.78,47.32 U2.43
PB0: length 13.6
  Top Layer w0.178: P3.7 83.27,42.8 82.77,43.29
PB1: length 17.3
  Top Layer w0.178: P3.8 97.5,41.58 95.48,41.58 94.71,42.36 83.21,42.36 U2.23
PB2: length 15
  Top Layer w0.178: P3.9 94.37,42.06 83.02,42.06 U2.22
PB3: length 18.6
  Top Layer w0.178: P3.10 97.61,39.15 95.44,39.15 92.84,41.75 82.83,41.75 U2.21
PB4: length 16.3
  Top Layer w0.178: P3.11 92.78,41.11 82.98,41.11 81.78,42.31
PB5: length 20.1
  Top Layer w0.203: P3.12 97.32,36.32 95.68,36.32 91.39,40.61 82.98,40.61 81.53,42.06
PB6: length 17.6
  Top Layer w0.178: U2.18 83.16,39.94 91.41,39.94 P3.13
PB7: length 21.3
  Top Layer w0.178: U2.17 83,39.6 90.09,39.6 95.72,33.98 97.52,33.98 P3.14
PB10: length 51.1
  Top Layer w0.178: U2.16 81.04,41.06 81.04,41.05 85.58,36.51 85.58,35.84 85.85,35.57 v1(85.85,35.47) 85.58,35.2 85.58,17.91 87.19,16.3 87.19,8.73 87.21,8.7 87.21,7.8 P1.A7 87.28,6.76 87.08,6.56 86.47,6.56 86.28,6.76 P1.B7
  Bottom Layer w0.178: P3.15 95.99,32.82 94.09,32.82 91.82,35.09 86.23,35.09 v1(85.85,35.47)
PB11: length 55.6
  Top Layer w0.178: v1(84.99,35.47) 84.99,35.52 ; 84.99,35.52 84.99,35.57 85.25,35.84 85.25,36.37 80.81,40.81 80.8,40.81 U2.15 ; 84.99,35.52 85.25,35.25 85.25,17.77 86.86,16.16 86.86,8.73 86.84,8.7 86.84,7.8 P1.A6 ; v1(87.98,9.35) 87.98,9.21 87.78,9 P1.B6
  Bottom Layer w0.178: 84.99,35.5 v1(84.99,35.47) 84.99,34.97 85.2,34.76 90.95,34.76 94.24,31.46 97.57,31.46 98.71,32.6 P3.16
  Bottom Layer w0.203: v1(86.55,9.35) v1(87.98,9.35)
PB12: length 22.1
  Top Layer w0.178: v1(82.7,36.73) 82.7,36.86 82.46,37.11 82.46,38.64 80.55,40.55 80.55,40.56 U2.14
  Bottom Layer w0.178: v1(82.7,36.73) 82.7,35.44 83.84,34.31 90.47,34.31 94.68,30.09 P3.17
PB13: length 26
  Top Layer w0.178: v1(81.83,36.73) 81.97,36.87 81.97,36.95 82.13,37.11 82.13,38.51 80.31,40.32 80.3,40.32 U2.13
  Bottom Layer w0.178: v1(81.83,36.73) 81.83,35.84 83.7,33.98 90.05,33.98 95.04,28.98 97.75,28.98 98.71,29.94 P3.18
PB14: length 24.1
  Top Layer w0.178: 79.8,40.33 81.12,39.01 81.12,34.82 v1(82.35,33.58)
  Bottom Layer w0.178: v1(82.35,33.58) 83.52,32.41 89.94,32.41 94.79,27.56 P3.19
PB15: length 28
  Top Layer w0.178: 79.55,40.08 80.79,38.84 80.79,34.25 v1(81.29,33.75)
  Bottom Layer w0.178: v1(81.29,33.75) 83.09,31.95 89.26,31.95 94.81,26.4 97.56,26.4 P3.20
PB18: length 18.4
  Top Layer w0.178: P3.1 95.04,50.42 94.12,49.5 94.12,47.44 92.64,45.95 81.63,45.95 U2.30
PB19: length 20.4
  Top Layer w0.178: 81.29,45.12 81.82,45.65 92.98,45.65 94.43,47.1 94.43,48.41 95.16,49.14 97.44,49.14 P3.2
PB20: length 15.9
  Top Layer w0.178: U2.28 82.01,45.34 93.1,45.34 94.63,46.87 95.17,46.87 P3.3
PB21: length 18.3
  Top Layer w0.178: U2.27 82.2,45.04 93.23,45.04 94.76,46.57 97.46,46.57 98.71,47.82 P3.4
PB23: length 54.1
  Top Layer w0.178: 82.28,44.13 82.53,44.39 91.71,44.39 91.76,44.43 94.83,44.43 95.27,44 97.38,44 P3.6 101.88,45.33 102.83,44.38 S2.2
VDCID: length 19.8
  Top Layer w0.178: 79.21,46.85 78.75,47.31 78.75,47.66 78.29,48.12 C8.1 ; C1.2 75.19,41.49 U2.1
  Top Layer w0.508: L1.2 71.65,39.63 72.66,40.64 73.96,40.64 74.27,40.95 74.27,41.49 ; C8.1 78.6,48.47 78.6,49.02 v1(78.59,49.03) ; v1(74.33,42.18) 74.3,42.15 C1.2
  Bottom Layer w0.508: v1(78.59,49.03) 76.8,47.24 76.8,43.31 75.69,42.2 74.35,42.2 v1(74.33,42.18)
VSW: length 6.2
  Top Layer w0.178: 73.75,39.92 73.46,39.63 L1.1 ; 73.75,39.92 73.76,39.91 74.09,39.91 ; 73.75,39.92 73.7,39.97 ; 73.75,39.92 73.88,40.04 74.23,40.04 ; 74.09,39.91 74.23,40.04 ; 74.09,39.91 73.68,39.49 ; 74.23,40.04 76.74,42.55
X32MI: length 6
  Top Layer w0.178: Y1.1 83.85,49.79 83.01,48.96 83.01,47.24 82.63,46.86 81.54,46.86 U2.32
X32MO: length 5.8
  Top Layer w0.178: Y1.3 85.75,47.49 84.81,46.56 81.73,46.56 U2.31
$1N3: length 9.9
  Top Layer w0.508: F1.1 57.08,6.15 57.02,6.1 57.02,5.59 57.38,5.23 58.82,5.23 59.18,4.87 59.18,2.38 SW1.3
$1N110: length 3.9
  Top Layer w0.178: P1.A5 85.78,9.7 84.64,10.83 84.64,10.85 84.43,11.07
$1N164: length 2.5
  Top Layer w0.254: R1.1 88.68,21.38 89,21.71 D1.1
$1N985: length 2.2
  Top Layer w0.254: R2.2 D2.2
$1N986: length 2.2
  Top Layer w0.254: R3.2 D3.2

## Copper pours and planes (outline as drawn; the poured copper is in the pictures)
GND on Top Layer: 80.95,52.97 101.58,52.97 101.58,51.88 80.95,51.88
GND on Top Layer: 43.47,54.4 106,54.4 106,0 43.47,0
GND on Bottom Layer: 43.47,54.4 106,54.4 106,-0.1 43.47,-0.1

Small or netless copper shapes (teardrops, artwork), in the pictures only: 137 on Top Layer, 24 on Bottom Layer

## Text on the board
Top Silkscreen Layer: FS | OFF | PA13 | PA12 | PA10 | PB17 | PB16 | PA4 | PA6 | PA3 | PA8 | PB9 | PB8 | GND | PA1 | ON | PA5 | PA0 | PA2 | PA15 | PA14 | PA11 | PA9 | PA7 | NFC_CTR | LED0 | LED1 | VCC | 3V3 | PB20 | PB22 | PB18 | PB10 | PB12 | PB14 | PB0 | PB2 | PB4 | PB6 | 5V | PB19 | PB21 | PB23 | PB1 | PB3 | PB5 | PB7 | PB11 | PB13 | PB15 | CH585M-R1-1v1
